# Altium schematic sheet Flexi_Quark_board.SchDoc: RP2040 CNC
size C; Author: AM; CompanyName: Expatria Technologies; DrawnBy: A.Marles; Engineer: AM; Organization: Expatria Technolgoies; Address1: Schematic; DocumentNumber: 2; SheetNumber: 2; SheetTotal: 14
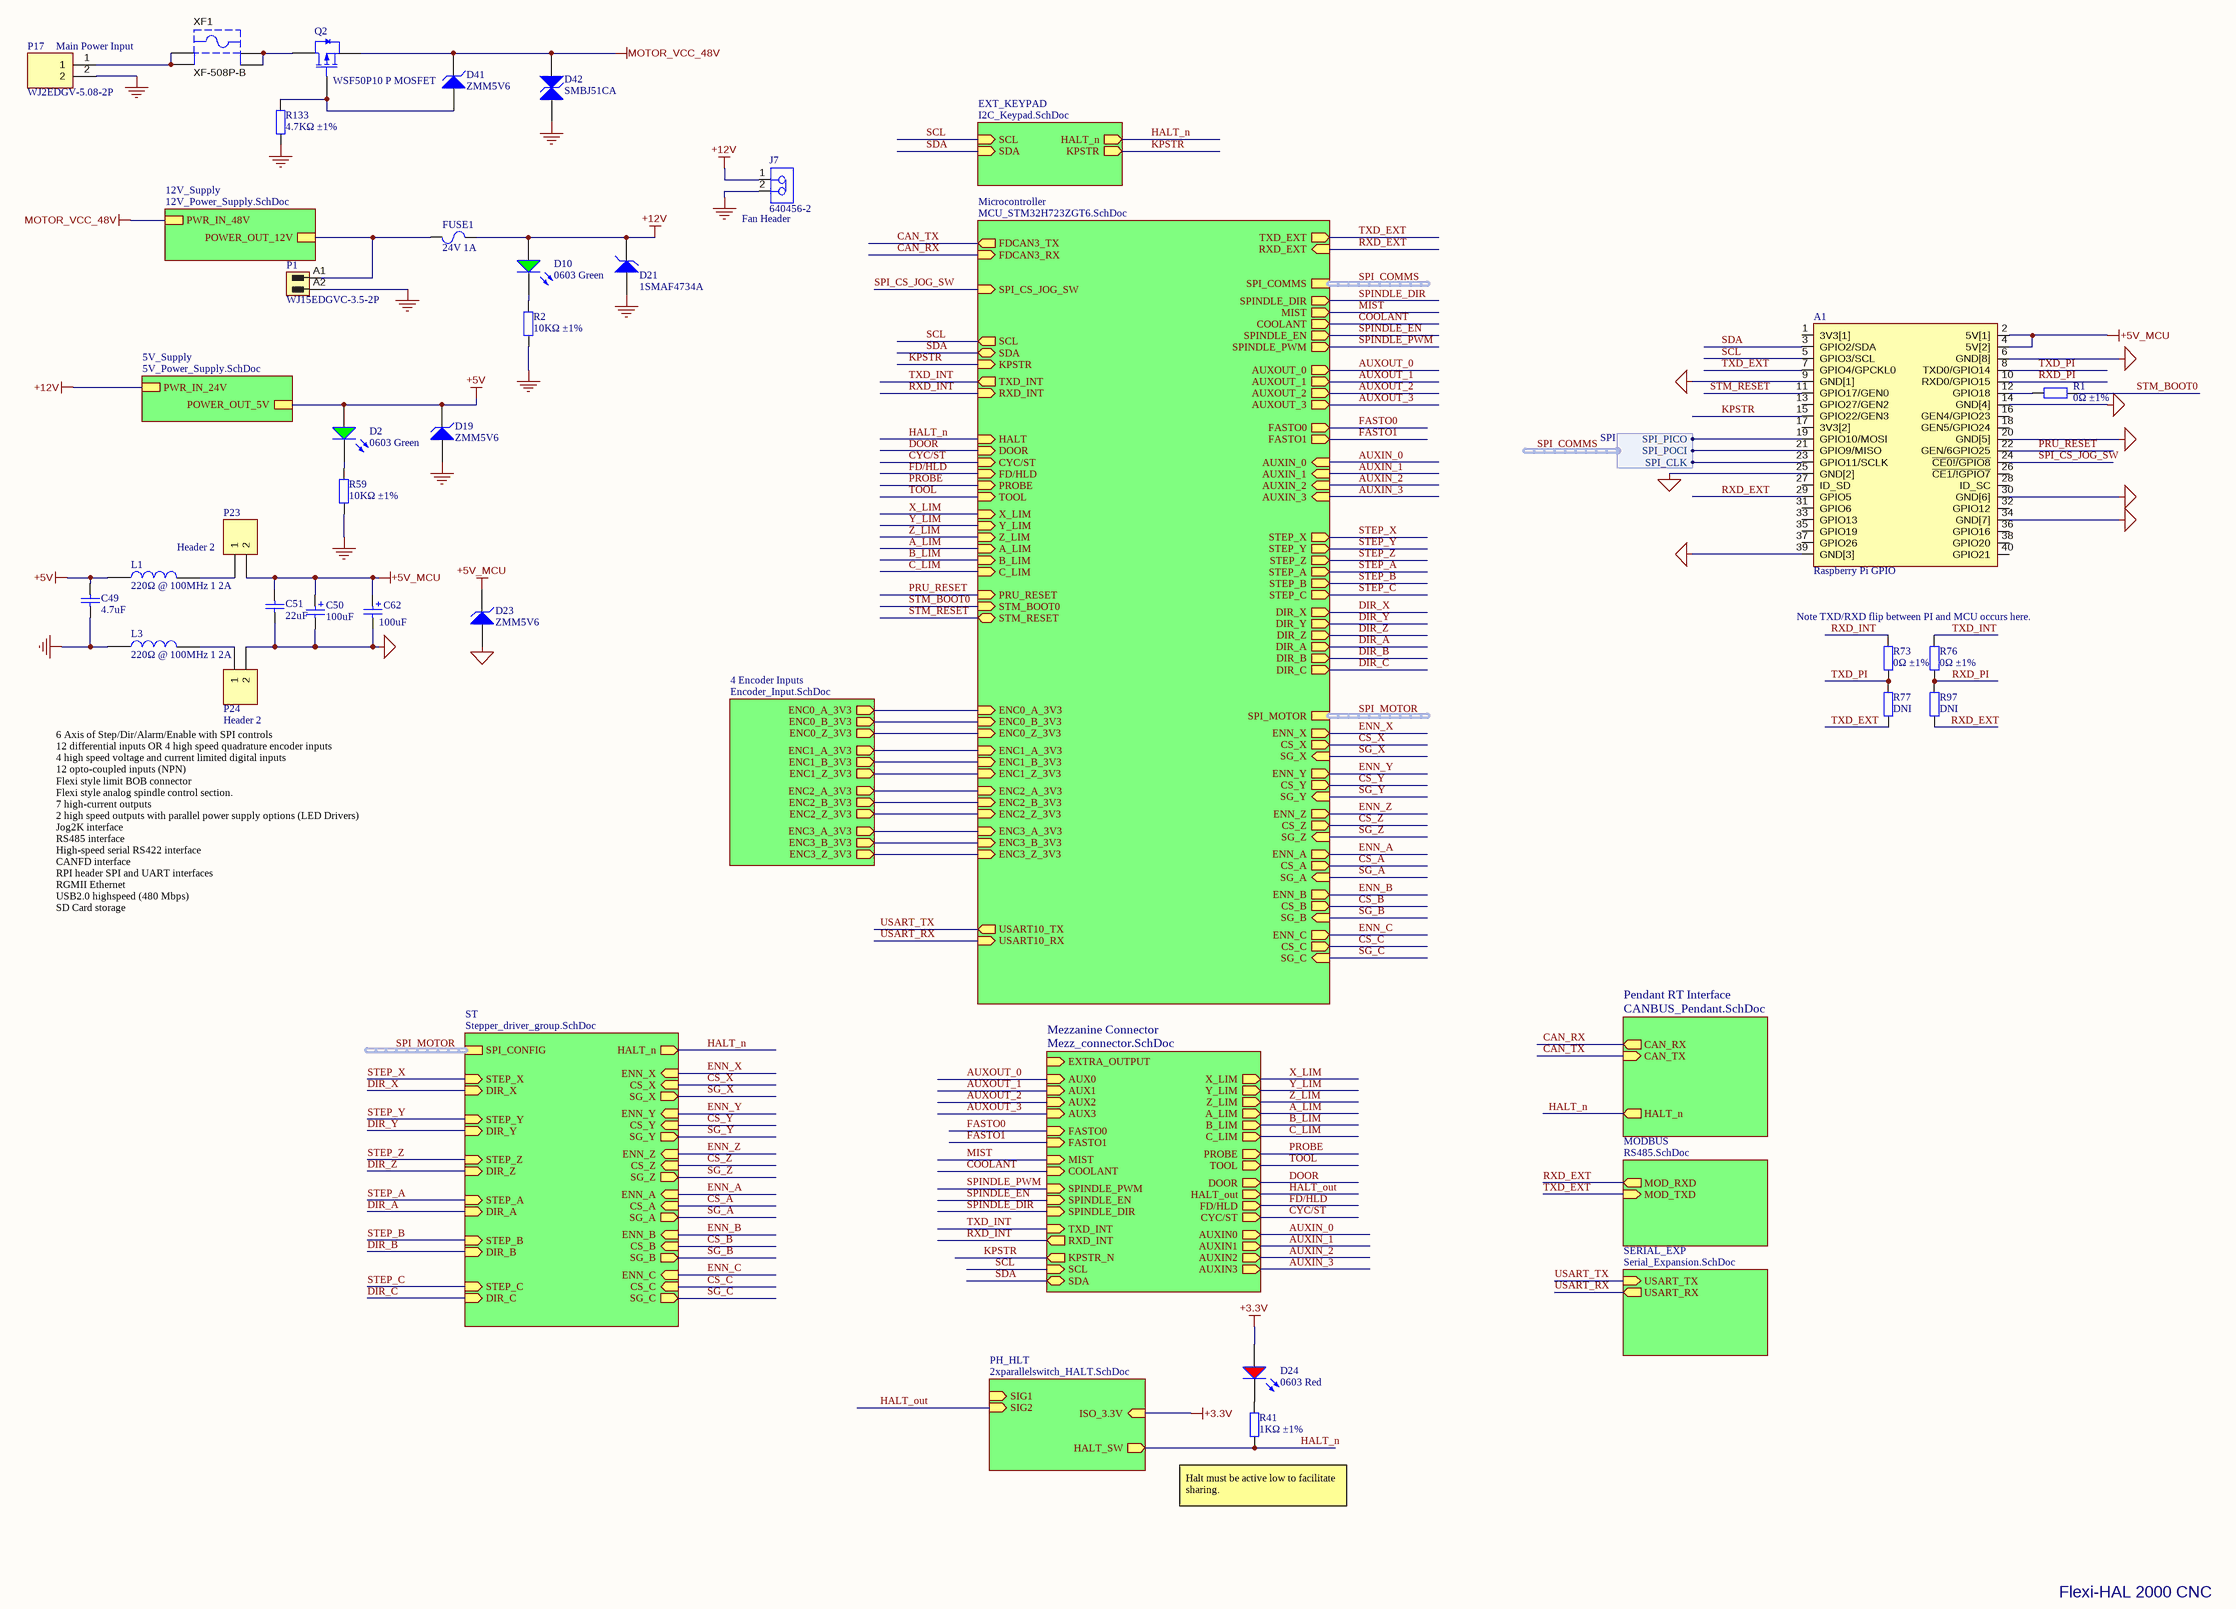
[diagram p0: Flexi_Quark_board.SchDoc]

## Parts
A1  Raspberry Pi GPIO  [MODULE_RASPBERRY_PI_4_MODEL_B]
C49  4.7uF  [0603_C]
C50  100uF  [CASE-B_3528]
C51  22uF  [0805_C]
C62  100uF  [WCAP-ASLI_D6.3H7.7]
D2  0603 Green  [0603_LED_S1]
D10  0603 Green  [0603_LED_S1]
D19  ZMM5V6  [LL-34]
D21  1SMAF4734A  [DIOM5226X240N]
D23  ZMM5V6  [LL-34]
D24  0603 Red  [0603_LED_S1]
D41  ZMM5V6  [LL-34]
D42  SMBJ51CA  [SMB(DO-214AA)_S1]
FUSE1  24V 1A  [1206_C]
J7  640456-2  [TECO-640456-2_V]
L1  220Ω @ 100MHz 1 2A  [0805_C]
L3  220Ω @ 100MHz 1 2A  [0805_C]
P1  WJ15EDGVC-3.5-2P  [691321100002]
P17  WJ2EDGV-5.08-2P  [WJ2EDGV5082P]
P23  Header 2  [HDR1X2]
P24  Header 2  [HDR1X2]
Q2  WSF50P10 P MOSFET  [TO-252-2-180]
R1  0Ω ±1%  [0603_R]
R2  10KΩ ±1%  [0603_R]
R41  1KΩ ±1%  [0603_R]
R59  10KΩ ±1%  [0603_R]
R73  0Ω ±1%  [0402_R]
R76  0Ω ±1%  [0402_R]
R77  DNI  [0402_R]  (no BOM)
R97  DNI  [0402_R]  (no BOM)
R133  4.7KΩ ±1%  [0603_R]
XF1  XF-508P-B  [KSTN-3568_V]

## Sub-sheets
4 Encoder Inputs = Encoder_Input.SchDoc: ENC0_B_3V3 (out), ENC1_Z_3V3 (out), ENC0_Z_3V3 (out), ENC2_Z_3V3 (out), ENC3_Z_3V3 (out), ENC1_B_3V3 (out), ENC0_A_3V3 (out), ENC1_A_3V3 (out), ENC3_A_3V3 (out), ENC3_B_3V3 (out), ENC2_B_3V3 (out), ENC2_A_3V3 (out)
5V_Supply = 5V_Power_Supply.SchDoc: POWER_OUT_5V, PWR_IN_24V
12V_Supply = 12V_Power_Supply.SchDoc: POWER_OUT_12V, PWR_IN_48V
EXT_KEYPAD = I2C_Keypad.SchDoc: HALT_n (out), SCL (in), KPSTR (out), SDA (in)
Mezzanine Connector = Mezz_connector.SchDoc: Y_LIM (out), Z_LIM (out), X_LIM (out), A_LIM (out), B_LIM (out), C_LIM (out), PROBE (out), TOOL (out), FD/HLD (out), CYC/ST (out), HALT_out (out), DOOR (out), AUXIN3 (out), AUXIN0 (out), AUXIN1 (out), AUXIN2 (out), AUX3 (in), AUX0 (in), AUX1 (in), AUX2 (in), SPINDLE_EN (in), SPINDLE_DIR (in), SPINDLE_PWM (in), COOLANT (in), MIST (in), FASTO1 (in), FASTO0 (in), SCL (in), SDA (bidir), KPSTR_N (out), TXD_INT (in), RXD_INT (out), EXTRA_OUTPUT (in)
Microcontroller = MCU_STM32H723ZGT6.SchDoc: RXD_INT (in), TXD_INT (out), SPINDLE_PWM (out), FD/HLD (in), CYC/ST (in), SPI_CS_JOG_SW (in), PROBE (in), TXD_EXT (out), SDA (bidir), A_LIM (in), SCL (out), KPSTR (in), RXD_EXT (in), SPINDLE_EN (out), HALT (in), PRU_RESET (in), X_LIM (in), Z_LIM (in), STM_BOOT0 (in), Y_LIM (in), B_LIM (in), DOOR (in), STM_RESET (bidir), AUXOUT_0 (out), AUXOUT_1 (out), AUXOUT_3 (out), AUXOUT_2 (out), ENC0_B_3V3 (in), ENC1_Z_3V3 (in), ENC0_Z_3V3 (in), ENC2_Z_3V3 (in), ENC3_Z_3V3 (in), ENC1_B_3V3 (in), ENC0_A_3V3 (in), ENC1_A_3V3 (in), ENC3_A_3V3 (in), ENC3_B_3V3 (in), ENC2_B_3V3 (in), ENC2_A_3V3 (in), SPINDLE_DIR (out), COOLANT (out), MIST (out), TOOL (in), SG_Y (in), CS_A (out), SG_Z (in), SG_X (in), ENN_A (out), CS_X (out), ENN_B (out), SG_B (in), CS_B (out), CS_Y (out), SG_A (in), ENN_Y (out), CS_Z (out), ENN_Z (out), ENN_X (out), ENN_C (out), SG_C (in), CS_C (out), DIR_B (out), DIR_Y (out), DIR_X (out), STEP_B (out), STEP_A (out), STEP_Z (out), STEP_Y (out), STEP_X (out), DIR_Z (out), DIR_A (out), STEP_C (out), DIR_C (out), AUXIN_0 (in), AUXIN_1 (in), AUXIN_2 (in), AUXIN_3 (in), SPI_COMMS (harness SPI), FDCAN3_TX (out), SPI_MOTOR (harness SPI), FDCAN3_RX (in), USART10_TX (out), USART10_RX (in), C_LIM (in), FASTO1 (out), FASTO0 (out)
MODBUS = RS485.SchDoc: MOD_TXD (in), MOD_RXD (out)
Pendant RT Interface = CANBUS_Pendant.SchDoc: HALT_n (out), CAN_RX (out), CAN_TX (in)
PH_HLT = 2xparallelswitch_HALT.SchDoc: ISO_3.3V (in), SIG1 (in), SIG2 (in), HALT_SW (out)
SERIAL_EXP = Serial_Expansion.SchDoc: USART_TX (in), USART_RX (out)
ST = Stepper_driver_group.SchDoc: STEP_Z (in), DIR_Z (in), STEP_X (in), STEP_B (in), DIR_X (in), DIR_A (in), DIR_Y (in), STEP_Y (in), DIR_B (in), STEP_A (in), SG_Y (out), CS_A (in), SG_Z (out), SG_X (out), ENN_A (in), CS_X (in), ENN_B (in), SG_B (out), CS_B (in), CS_Y (in), SG_A (out), ENN_Y (in), CS_Z (in), SPI_CONFIG (harness SPI), ENN_Z (in), ENN_X (in), STEP_C (in), DIR_C (in), ENN_C (in), SG_C (out), CS_C (in), HALT_n (out)

## Harnesses
SPI: SPI_CLK, SPI_PICO, SPI_POCI

## Nets
+3.3V: D24.A ; sheet PH_HLT/ISO_3.3V
+5V: C49.2 D2.A D19.2(K) L1.1 ; sheet 5V_Supply/POWER_OUT_5V
+5V_MCU: A1.2(5V[1]) A1.4(5V[2]) C50.1 C51.2 C62.1(P) D23.2(K) P23.2
+12V: D10.A D21.2(K) FUSE1.2 J7.1 ; sheet 5V_Supply/PWR_IN_24V
GND: C49.1 D19.1(A) D21.1(A) D42.1(A) J7.2 L3.1 P1.A2 P17.2 R2.1 R59.1 R133.1
MCU_GND: A1.6(GND[8]) A1.9(GND[1]) A1.14(GND[4]) A1.20(GND[5]) A1.25(GND[2]) A1.30(GND[6]) A1.34(GND[7]) A1.39(GND[3]) C50.2 C51.1 C62.2(N) D23.1(A) P24.2
MOTOR_VCC_48V: D41.2(K) D42.2(K) Q2.2(S) ; sheet 12V_Supply/PWR_IN_48V
A_LIM: sheet Microcontroller/A_LIM, sheet Mezzanine Connector/A_LIM
AUXIN_0: sheet Microcontroller/AUXIN_0, sheet Mezzanine Connector/AUXIN0
AUXIN_1: sheet Microcontroller/AUXIN_1, sheet Mezzanine Connector/AUXIN1
AUXIN_2: sheet Microcontroller/AUXIN_2, sheet Mezzanine Connector/AUXIN2
AUXIN_3: sheet Microcontroller/AUXIN_3, sheet Mezzanine Connector/AUXIN3
AUXOUT_0: sheet Microcontroller/AUXOUT_0, sheet Mezzanine Connector/AUX0
AUXOUT_1: sheet Microcontroller/AUXOUT_1, sheet Mezzanine Connector/AUX1
AUXOUT_2: sheet Microcontroller/AUXOUT_2, sheet Mezzanine Connector/AUX2
AUXOUT_3: sheet Microcontroller/AUXOUT_3, sheet Mezzanine Connector/AUX3
B_LIM: sheet Microcontroller/B_LIM, sheet Mezzanine Connector/B_LIM
C_LIM: sheet Microcontroller/C_LIM, sheet Mezzanine Connector/C_LIM
CAN_RX: sheet Microcontroller/FDCAN3_RX, sheet Pendant RT Interface/CAN_RX
CAN_TX: sheet Microcontroller/FDCAN3_TX, sheet Pendant RT Interface/CAN_TX
COOLANT: sheet Microcontroller/COOLANT, sheet Mezzanine Connector/COOLANT
CS_A: sheet ST/CS_A, sheet Microcontroller/CS_A
CS_B: sheet ST/CS_B, sheet Microcontroller/CS_B
CS_C: sheet ST/CS_C, sheet Microcontroller/CS_C
CS_X: sheet ST/CS_X, sheet Microcontroller/CS_X
CS_Y: sheet ST/CS_Y, sheet Microcontroller/CS_Y
CS_Z: sheet ST/CS_Z, sheet Microcontroller/CS_Z
CYC/ST: sheet Microcontroller/CYC/ST, sheet Mezzanine Connector/CYC/ST
DIR_A: sheet ST/DIR_A, sheet Microcontroller/DIR_A
DIR_B: sheet ST/DIR_B, sheet Microcontroller/DIR_B
DIR_C: sheet ST/DIR_C, sheet Microcontroller/DIR_C
DIR_X: sheet ST/DIR_X, sheet Microcontroller/DIR_X
DIR_Y: sheet ST/DIR_Y, sheet Microcontroller/DIR_Y
DIR_Z: sheet ST/DIR_Z, sheet Microcontroller/DIR_Z
DOOR: sheet Microcontroller/DOOR, sheet Mezzanine Connector/DOOR
ENN_A: sheet ST/ENN_A, sheet Microcontroller/ENN_A
ENN_B: sheet ST/ENN_B, sheet Microcontroller/ENN_B
ENN_C: sheet ST/ENN_C, sheet Microcontroller/ENN_C
ENN_X: sheet ST/ENN_X, sheet Microcontroller/ENN_X
ENN_Y: sheet ST/ENN_Y, sheet Microcontroller/ENN_Y
ENN_Z: sheet ST/ENN_Z, sheet Microcontroller/ENN_Z
FASTO0: sheet Microcontroller/FASTO0, sheet Mezzanine Connector/FASTO0
FASTO1: sheet Microcontroller/FASTO1, sheet Mezzanine Connector/FASTO1
FD/HLD: sheet Microcontroller/FD/HLD, sheet Mezzanine Connector/FD/HLD
HALT_n: R41.2 ; sheet ST/HALT_n, sheet EXT_KEYPAD/HALT_n, sheet Microcontroller/HALT, sheet Pendant RT Interface/HALT_n, sheet PH_HLT/HALT_SW
HALT_out: sheet Mezzanine Connector/HALT_out, sheet PH_HLT/SIG2
KPSTR: A1.15(GPIO22/GEN3) ; sheet EXT_KEYPAD/KPSTR, sheet Microcontroller/KPSTR, sheet Mezzanine Connector/KPSTR_N
MIST: sheet Microcontroller/MIST, sheet Mezzanine Connector/MIST
PROBE: sheet Microcontroller/PROBE, sheet Mezzanine Connector/PROBE
PRU_RESET: A1.22(GEN/6GPIO25) ; sheet Microcontroller/PRU_RESET
RXD_EXT: A1.29(GPIO5) R97.1 ; sheet MODBUS/MOD_RXD, sheet Microcontroller/RXD_EXT
RXD_INT: R73.2 ; sheet Microcontroller/RXD_INT, sheet Mezzanine Connector/RXD_INT
RXD_PI: A1.10(RXD0/GPIO15) R76.1 R97.2
SCL: A1.5(GPIO3/SCL) ; sheet EXT_KEYPAD/SCL, sheet Microcontroller/SCL, sheet Mezzanine Connector/SCL
SDA: A1.3(GPIO2/SDA) ; sheet EXT_KEYPAD/SDA, sheet Microcontroller/SDA, sheet Mezzanine Connector/SDA
SG_A: sheet ST/SG_A, sheet Microcontroller/SG_A
SG_B: sheet ST/SG_B, sheet Microcontroller/SG_B
SG_C: sheet ST/SG_C, sheet Microcontroller/SG_C
SG_X: sheet ST/SG_X, sheet Microcontroller/SG_X
SG_Y: sheet ST/SG_Y, sheet Microcontroller/SG_Y
SG_Z: sheet ST/SG_Z, sheet Microcontroller/SG_Z
SPI_COMMS.SPI_CLK: A1.23(GPIO11/SCLK) ; sheet Microcontroller/SPI_COMMS.SPI_CLK
SPI_COMMS.SPI_PICO: A1.19(GPIO10/MOSI) ; sheet Microcontroller/SPI_COMMS.SPI_PICO
SPI_COMMS.SPI_POCI: A1.21(GPIO9/MISO) ; sheet Microcontroller/SPI_COMMS.SPI_POCI
SPI_CS_JOG_SW: A1.24(~{CE0!/GPIO8}) ; sheet Microcontroller/SPI_CS_JOG_SW
SPINDLE_DIR: sheet Microcontroller/SPINDLE_DIR, sheet Mezzanine Connector/SPINDLE_DIR
SPINDLE_EN: sheet Microcontroller/SPINDLE_EN, sheet Mezzanine Connector/SPINDLE_EN
SPINDLE_PWM: sheet Microcontroller/SPINDLE_PWM, sheet Mezzanine Connector/SPINDLE_PWM
STEP_A: sheet ST/STEP_A, sheet Microcontroller/STEP_A
STEP_B: sheet ST/STEP_B, sheet Microcontroller/STEP_B
STEP_C: sheet ST/STEP_C, sheet Microcontroller/STEP_C
STEP_X: sheet ST/STEP_X, sheet Microcontroller/STEP_X
STEP_Y: sheet ST/STEP_Y, sheet Microcontroller/STEP_Y
STEP_Z: sheet ST/STEP_Z, sheet Microcontroller/STEP_Z
STM_BOOT0: R1.1 ; sheet Microcontroller/STM_BOOT0
STM_RESET: A1.11(GPIO17/GEN0) ; sheet Microcontroller/STM_RESET
TOOL: sheet Microcontroller/TOOL, sheet Mezzanine Connector/TOOL
TXD_EXT: A1.7(GPIO4/GPCKL0) R77.1 ; sheet MODBUS/MOD_TXD, sheet Microcontroller/TXD_EXT
TXD_INT: R76.2 ; sheet Microcontroller/TXD_INT, sheet Mezzanine Connector/TXD_INT
TXD_PI: A1.8(TXD0/GPIO14) R73.1 R77.2
USART_RX: sheet Microcontroller/USART10_RX, sheet SERIAL_EXP/USART_RX
USART_TX: sheet Microcontroller/USART10_TX, sheet SERIAL_EXP/USART_TX
X_LIM: sheet Microcontroller/X_LIM, sheet Mezzanine Connector/X_LIM
Y_LIM: sheet Microcontroller/Y_LIM, sheet Mezzanine Connector/Y_LIM
Z_LIM: sheet Microcontroller/Z_LIM, sheet Mezzanine Connector/Z_LIM
NetA1_12: A1.12(GPIO18) R1.2
NetD2_K: D2.K R59.2
NetD10_K: D10.K R2.2
NetD24_K: D24.K R41.1
NetD41_1: D41.1(A) Q2.1(G) R133.2
NetFUSE1_1: FUSE1.1 P1.A1 ; sheet 12V_Supply/POWER_OUT_12V
NetL1_2: L1.2 P23.1
NetL3_2: L3.2 P24.1
NetP17_1: P17.1 XF1.1 XF1.2
NetQ2_3: Q2.3(D) XF1.3 XF1.4
(unnamed): sheet Microcontroller/ENC0_B_3V3, sheet 4 Encoder Inputs/ENC0_B_3V3
(unnamed): sheet Microcontroller/ENC1_Z_3V3, sheet 4 Encoder Inputs/ENC1_Z_3V3
(unnamed): sheet Microcontroller/ENC0_Z_3V3, sheet 4 Encoder Inputs/ENC0_Z_3V3
(unnamed): sheet Microcontroller/ENC2_Z_3V3, sheet 4 Encoder Inputs/ENC2_Z_3V3
(unnamed): sheet Microcontroller/ENC3_Z_3V3, sheet 4 Encoder Inputs/ENC3_Z_3V3
(unnamed): sheet Microcontroller/ENC1_B_3V3, sheet 4 Encoder Inputs/ENC1_B_3V3
(unnamed): sheet Microcontroller/ENC0_A_3V3, sheet 4 Encoder Inputs/ENC0_A_3V3
(unnamed): sheet Microcontroller/ENC1_A_3V3, sheet 4 Encoder Inputs/ENC1_A_3V3
(unnamed): sheet Microcontroller/ENC3_A_3V3, sheet 4 Encoder Inputs/ENC3_A_3V3
(unnamed): sheet Microcontroller/ENC3_B_3V3, sheet 4 Encoder Inputs/ENC3_B_3V3
(unnamed): sheet Microcontroller/ENC2_B_3V3, sheet 4 Encoder Inputs/ENC2_B_3V3
(unnamed): sheet Microcontroller/ENC2_A_3V3, sheet 4 Encoder Inputs/ENC2_A_3V3

Not connected (* = marked no-connect by the designer): A1 1(3V3[1]) 13(GPIO27/GEN2) 16(GEN4/GPIO23) 17(3V3[2]) 18(GEN5/GPIO24) 26(~{CE1/!GPIO7}) 27(ID_SD) 28(ID_SC) 31(GPIO6) 32(GPIO12) 33(GPIO13) 35(GPIO19) 36(GPIO16) 37(GPIO26) 38(GPIO20) 40(GPIO21)

## Buses and harness runs
harness SPI_COMMS = sheet Microcontroller/SPI_COMMS
harness SPI_MOTOR = sheet Microcontroller/SPI_MOTOR
harness SPI_MOTOR = sheet ST/SPI_CONFIG

## Notes on the sheet
- (near P17) Main Power Input
- (near J7) Fan Header
- Note TXD/RXD flip between PI and MCU occurs here.
- 6 Axis of Step/Dir/Alarm/Enable with SPI controls
  12 differential inputs OR 4 high speed quadrature encoder inputs
  4 high speed voltage and current limited digital inputs
  12 opto-coupled inputs (NPN)
  Flexi style limit BOB connector
  Flexi style analog spindle control section.
  7 high-current outputs
  2 high speed outputs with parallel power supply options (LED Drivers)
  Jog2K interface
  RS485 interface
  High-speed serial RS422 interface
  CANFD interface
  RPI header SPI and UART interfaces
  RGMII Ethernet
  USB2.0 highspeed (480 Mbps)
  SD Card storage
- (near R41) Halt must be active low to facilitate sharing.
- Flexi-HAL 2000 CNC
- Expatria Technologies
- SHEET
- PROJECT
- REV
- 1136 Glade Court
- Port Coquitlam, BC V3B 1R5
- EMAIL: INFO@EXPATRIA.CA
- SIZE
- ENGR
- C
- MODIFIED
- DOCUMENT
- /
- Copyright Expatria Technologies 2022. This document describes Open Hardware and is licensed under the CERN-OHL-S v2. No warranty is implied or expressed.

## Library data of the parts
A1 = ADA3708: Raspberry Pi Zero WH _Zero W with Headers_; MP: DS1023-2*20SF11; MF: CONNFLY Elec; Availability: Unavailable; Package: None; Value: *; Price: None; SuppliersPartNumber: C132132
C49 = 0603 4.7uF (475) 10% 16V: Chip capacitors; Manufacturer: Samsung Electro-Mechanics; PartNumber: CL10A475KO8NNNC; Tolerance: 10%; Voltage: 16V; ComponentLink1Description: Supplier link; ComponentLink1URL: http://www.szlcsc.com/product/details_20375.html; Package: 0603; Supplier: LC; SuppliersPartNumber: C19666; Capacitance: 4.7uF
C50 = 3528 100uF (107) 10% 6.3V: Tantalum capacitor; Manufacturer: AVX; PartNumber: TAJB107K006RNJ; Tolerance: 10%; Voltage: 6.3V; ComponentLink1Description: Supplier link; ComponentLink1URL: http://www.szlcsc.com/product/details_16815.html; Package: 3528; Supplier: LC; SuppliersPartNumber: C16133; Capacitance: 100uF
C51 = 0805 22uF (226) 20% 25V: Chip capacitors; Manufacturer: Samsung Electro-Mechanics; PartNumber: CL21A226MAQNNNE; Tolerance: 20%; Voltage: 25V; ComponentLink1Description: Supplier link; ComponentLink1URL: http://www.szlcsc.com/product/details_46786.html; Package: 0805; Supplier: LC; SuppliersPartNumber: C2922481; Capacitance: 22uF
C62 = 865080445010: -45℃~+105℃ 2000hrs@105℃ 100uF 7.7mm 35V 6.3mm ±20% SMD,6.3x7.7mm Aluminum Electrolytic Capacitors - SMD ROHS; Manufacturer: Capxon International Elec; SuppliersPartNumber: C59934; Value: 100uF
D2 D10 = 0603 LED Green: LED; ComponentLink1Description: 供应商链接; ComponentLink1URL: http://www.szlcsc.com/product/details_73152.html; Package: 0603; Supplier: LC; SuppliersPartNumber: C72043; Color: Green
D19 D23 D41 = LL-34 ZMM5V6: 500mW - 0.1uA @ 1V 5.6V LL-34 Zener Diodes ROHS; ComponentLink1Description: 供应商链接; ComponentLink1URL: http://www.szlcsc.com/product/details_8541.html; Package: LL-34; Supplier: LC; SuppliersPartNumber: C8062
D21 = BZT52C27: 27V ±5% 1W 500nA @ 20.5V SMA(DO-214AC) Zener Diodes RoHS; ComponentLink1Description: 供应商链接; ComponentLink1URL: http://www.szlcsc.com/product/details_8541.html; Package: SMAF; Supplier: LC; SuppliersPartNumber: C169539
D24 = 0603 LED Red: LED; ComponentLink1Description: 供应商链接; ComponentLink1URL: http://www.szlcsc.com/product/details_2659.html; Package: 0603; Supplier: LC; SuppliersPartNumber: C2286; Color: Red
D42 = SMB/DO-214AA P6SMB6.8CA: 82.4V 56.7V 51V SMB(DO-214AA) TVS ROHS; ComponentLink1Description: 供应商链接; ComponentLink1URL: http://www.szlcsc.com/product/details_79530.html; Package: SMB/DO-214AA; Supplier: LC; SuppliersPartNumber: C151265
FUSE1 = JK-nSMD050-24: 24V 1A 0.1s 1206 PTC Resettable Fuses RoHS; Manufacturer: Jinrui Electronic Materials Co.; Package: 1206; Supplier: LC; SuppliersPartNumber: C369160; PartNumber: JK-nSMD050-24
J7 = CMP-2000-05417-1: Male Header, Pitch 2.54 mm, 1 x 2 Position, Height 10.49 mm, Tail Length 3.556 mm, -55 to 105 degC, RoHS, Bulk; Manufacturer: TE Connectivity; Standards: RoHSCompliant,ELVCompliant,UL94V-0; Material, Housing: Polyester; Agency Approvals: CSA,UL; Brand/Series: MTA-100Series; Contact Centerline Spacing: 0.100 / in.; Material, Contact: CopperAlloy; Current, Rating: 5 / A; Color, Housing: White; Contact Termination Area Plating: Tin; Special Features: Pinstrip; Number of Positions: 2; Pin Spacing: 0.1 / "; Temperature, Operating: -55to+105 / degC; Angle: Straight; Mount Angle: Vertical; Connector Type: MTA-100; Primary Type: InterconnectSystem; Voltage, Rating: 250 / V; Mounting Hole Size: 0.04 / "; Number of Rows: 1; Termination: Solder; Length, Terminal Post: 0.14 / in.; Manufacturer URL: http://www.te.com/; Color: White; Size, Post: 0.025 / in.; Contact Shape: Square; Mounting Type: PCMount; Datasheet URL: https://datasheet.ciiva.com/11746/0900766b80eb7fdd-11746365.pdf; Type: PCBPlug; Datasheet Version: Rev. W, 06/2004; Number of Contacts: 2; Flammability Rating: UL94V-0; Contact Plating: Tin; Length, Pin: 0.14 / "; Contact Mating Area Plating: Tin; Length, Overall: 0.2 / "; SuppliersPartNumber: C86502
L1 L3 = 0402 220R@100Mhz 0.1A: 220Ω @ 100MHz 1 2A 150mΩ 0805 Ferrite Beads ROHS; Notepad: *; Package: 0805; Supplier: LC; SuppliersPartNumber: C139188
P1 = 3.5mm Terminal Header 2p: Header,Male Pin,Covered(4 Sided) 2 1 0.138"（3.50mm） 2 P=3.5mm Pluggable System Terminal Block RoHS; Manufacturer: Weidmueller; Manufacturer 1: Weidmuller; Manufacturer Part Number 1: 1604470000; UL_94_flammability_rating: V-0; Pitch_mm: 3.5 mm; Side_termination_characteristic: closed side; Pitch_inch: 0.138 inch; Solder_pin_length_mm: 3.2 mm; Short_text_for_material: SL 3.50/02/180G 3.2SN OR BX; ComponentLink1Description: Manufacturer URL; ComponentLink1URL: http://www.weidmueller.com/; PartNumber: WJ15EDGVC-3.5-2P; Revision: V1; PackageReference: SL_3_50_180G_02; Packaging: Box; SuppliersPartNumber: C192777
P17 = WJ2EDGV-5.08-2P: 5.08mm Green Board Edge/Receptacle-Open Straight,P=5.08mm Pluggable System Terminal Block ROHS; Manufacturer_Name: Ningbo Kangnex; Manufacturer: Kangnex; SuppliersPartNumber: C8461; Datasheet Link: https://datasheet.lcsc.com/szlcsc/1912251635_Ningbo-Kangnex-Elec-WJ2EDGV-5-08-2P_C8461.pdf; Height: 12.4mm; Manufacturer_Part_Number: WJ2EDGV-5.08-2P; Supplier 1: LCSC; Supplier Part Number 1: C8461; Manufacturer Part Number: WJ2EDGV-5.08-2P; RoHS: No
P23 P24 = Header 2: Header, 2-Pin; Publisher: Altium Limited; LatestRevisionDate: 17-Jul-2002; LatestRevisionNote: Re-released for DXP Platform.; SuppliersPartNumber: C234182
Q2 = WSF50P10 P TO-252-2: 100V 34A 32mΩ@10V,18A 96W P Channel TO-252-2 MOSFETs ROHS; ComponentLink1Description: 供应商链接; ComponentLink1URL: http://www.szlcsc.com/product/details_15801.html; Package: TO-252-2; Supplier: LC; SuppliersPartNumber: C2758447
R1 = 0603 0R (0R0) 1%: Chip resistor; Manufacturer: Uniroyal Elec; PartNumber: 0603WAF0000T5E; Power: 1/10W; ComponentLink1Description: Supplier link; ComponentLink1URL: http://www.szlcsc.com/product/details_21903.html; Package: 0603; Supplier: LC; SuppliersPartNumber: C21189; Resistance: 0Ω; Tolerance: 1%
R2 R59 = 0603 10K (1002) 1%: Chip resistor; Manufacturer: Uniroyal Elec; PartNumber: 0603WAF1002T5E; Power: 1/10W; ComponentLink1Description: Supplier link; ComponentLink1URL: http://www.szlcsc.com/product/details_26547.html; Package: 0603; Supplier: LC; SuppliersPartNumber: C25804; Resistance: 10KΩ; Tolerance: 1%
R41 = 0603 1K (1001) 1%: Chip resistor; Manufacturer: Uniroyal Elec; PartNumber: 0603WAF1001T5E; Power: 1/10W; ComponentLink1Description: Supplier link; ComponentLink1URL: http://www.szlcsc.com/product/details_21904.html; Package: 0603; Supplier: LC; SuppliersPartNumber: C21190; Resistance: 1KΩ; Tolerance: 1%
R73 R76 = 0402 0R (0R0) 1%: Chip resistor; Manufacturer: Uniroyal Elec; PartNumber: 0402WGF0000TCE; Power: 1/16W; ComponentLink1Description: Supplier link; ComponentLink1URL: http://www.szlcsc.com/product/details_17853.html; Package: 0402; Supplier: LC; SuppliersPartNumber: C17168; Resistance: 0Ω; Tolerance: 1%
R77 R97 = 0402 0R (0R0) 1%: Chip resistor; Manufacturer: Uniroyal Elec; PartNumber: 0402WGF0000TCE; Power: 1/16W; Resistance: 0Ω; Tolerance: 1%; ComponentLink1Description: Supplier link; ComponentLink1URL: http://www.szlcsc.com/product/details_17853.html; Package: 0402; Supplier: LC; SuppliersPartNumber: C17168
R133 = 0603 4.7K (4701) 1%: Chip resistor; Manufacturer: Uniroyal Elec; PartNumber: 0603WAF4701T5E; Power: 1/10W; ComponentLink1Description: Supplier link; ComponentLink1URL: http://www.szlcsc.com/product/details_23889.html; Package: 0603; Supplier: LC; SuppliersPartNumber: C23162; Resistance: 4.7KΩ; Tolerance: 1%
XF1 = XF-508P-B: Fuse Holder, 20 A, 500 V, -50 to 145 degC, 4-Pin THD, RoHS; Manufacturer: XFCN; Mounting Technology: ThroughHole; Package Description: 4-Pin Through Hole Device, Body 16 x 6.73 mm, Pitch 9.9 mm; SuppliersPartNumber: C2935468; Supplier: LCSC; Manufacturer Part Number: XF-508P-B